# EAGLE design Kube-Module-OLED_AmbiMate (EAGLE 9.5.2)
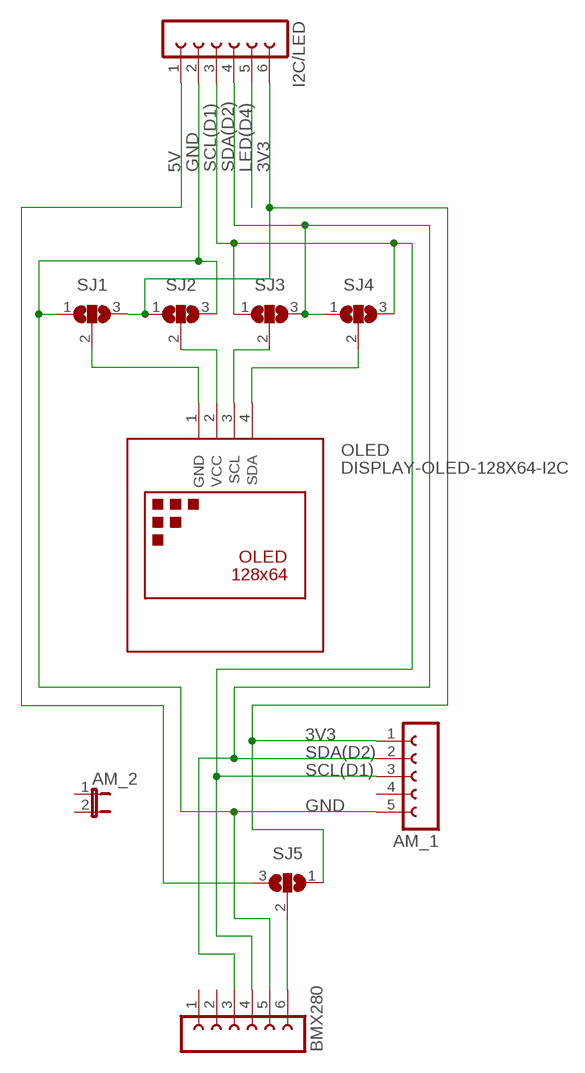
[diagram p0: schematic, sheet 1]

## Parts
AM_1  FE05-1  [FE05-1]
AM_2  JP1E  [JP1]
BMX280  FE06-1  [FE06]
I2C/LED  FE06-1  [FE06]
OLED  DISPLAY-OLED-128X64-I2C  [DISPLAY-OLED-128X64-I2C]
SJ1  SJ2W  [SJ_2]
SJ2  SJ2W  [SJ_2]
SJ3  SJ2W  [SJ_2]
SJ4  SJ2W  [SJ_2]
SJ5  SJ2W  [SJ_2]

## Nets
3V3: AM_1.1 I2C/LED.6 SJ1.3 SJ2.1 SJ5.1
5V: I2C/LED.1 SJ5.3
BMX_VCC: BMX280.6 SJ5.2
GND: AM_1.5 BMX280.5 I2C/LED.2 SJ1.1 SJ2.3
LED(D4): I2C/LED.5
OP1: OLED.1(GND) SJ1.2
OP2: OLED.2(VCC) SJ2.2
OP3: OLED.3(SCL) SJ3.2
OP4: OLED.4(SDA) SJ4.2
SCL(D1): AM_1.3 BMX280.4 I2C/LED.3 SJ3.1 SJ4.3
SDA(D2): AM_1.2 BMX280.3 I2C/LED.4 SJ3.3 SJ4.1
Unconnected: AM_1.4 AM_2.1 AM_2.2 BMX280.1 BMX280.2

## Library data of the parts
AM_1 = con-lsta:FE05-1: FEMALE HEADER; OC_FARNELL: unknown; OC_NEWARK: unknown
AM_2 = jumper:JP1E: JUMPER
BMX280 I2C/LED = con-lsta:FE06-1: FEMALE HEADER; OC_FARNELL: unknown; OC_NEWARK: unknown
OLED = diy-modules:DISPLAY-OLED-128X64-I2C: 128x64 Dot Matrix OLED Module based on SSD1306 chip Variant with I2C interface More details available here: http://www.instructables.com/id/Monochrome-096-i2c-OLED-display-with-arduino-SSD13/ SSD1306 datasheet: https://cdn-shop.adafruit.com/datasheets/SSD1306.pdf Click here to find device on ebay.com <http://www.ebay.com/sch/oled+display+128x64+iic> Note: There are two variants: I2C and SPI. Search for the proper version.
SJ1-SJ5 = jumper:SJ2W: SMD solder JUMPER

## Board
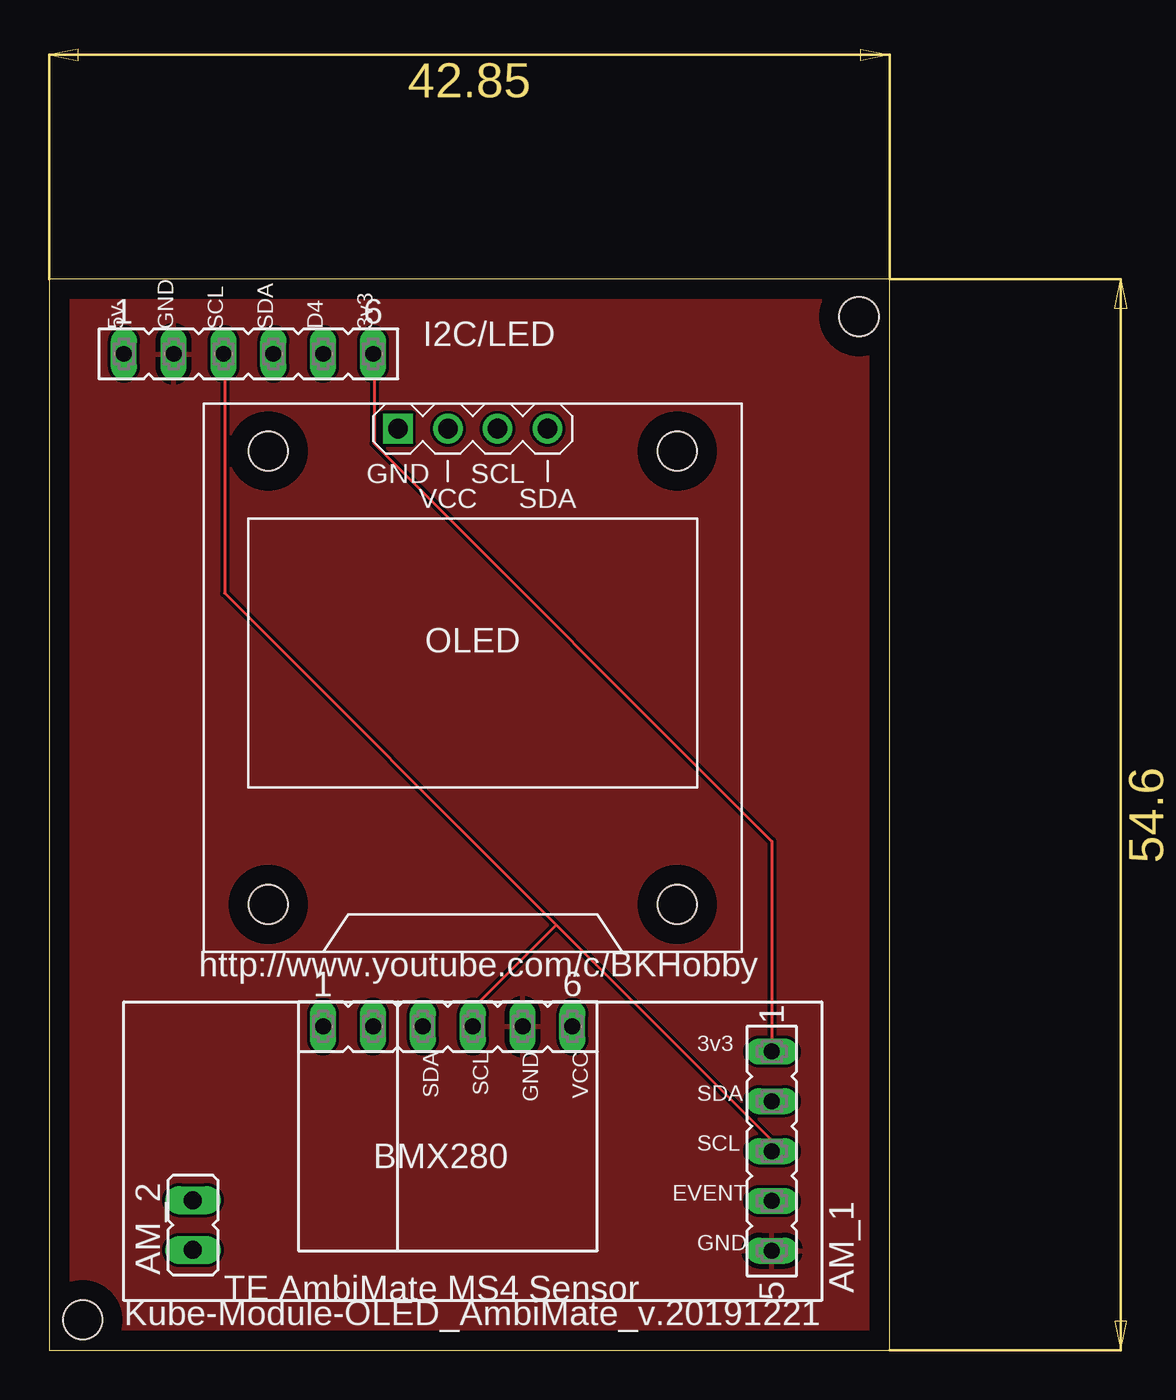
[diagram p1: board, top side]
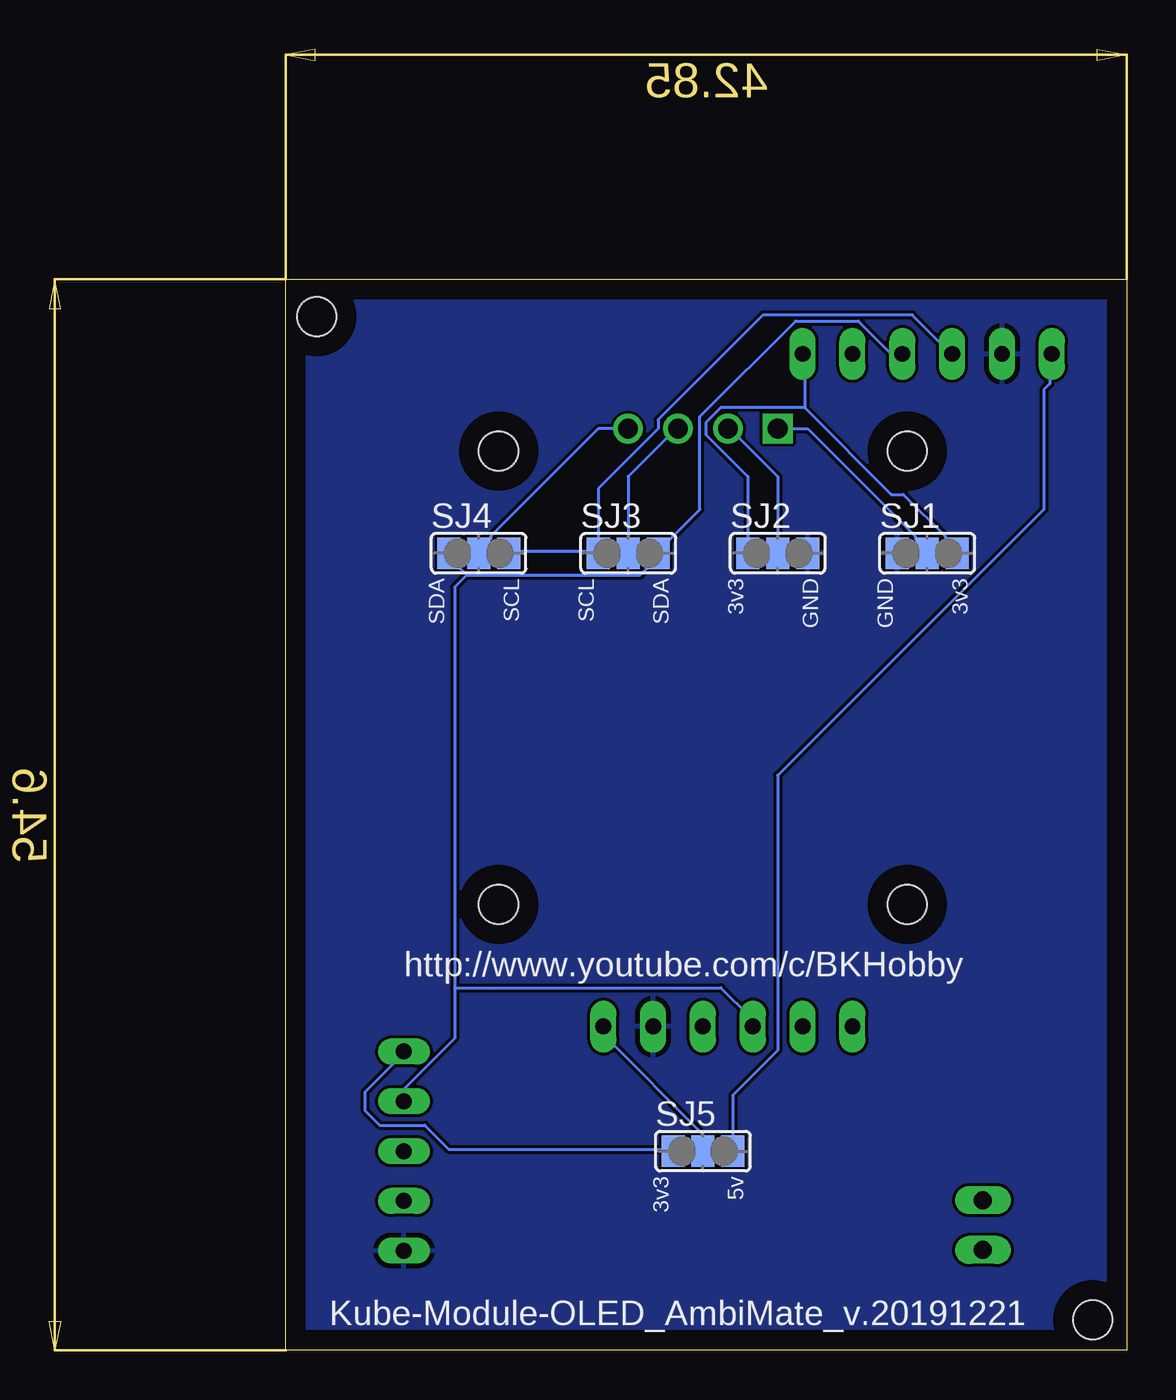
[diagram p2: board, bottom side, seen from below]

Size 42.85 x 54.6 mm. Coordinates in mm from the lower left corner, seen from the top.
Outline: 0,0 42.85,0 42.85,54.6 0,54.6 0,0
Copper layers (1*16): Top 0.035mm / dielectric 1.5mm / Bottom 0.035mm
Design rules "default": minimum track width 6mil, minimum drill 0.35mm, track to track 6mil, track to pad 6mil, pad to pad 6mil, via to via 6mil, smd to smd 6mil, copper to edge 40mil, drill to drill 6mil, minimum pad ring 10mil, minimum via ring 8mil, stop-mask expansion 4mil, vias tented up to drill 0mil, thermal gap 10mil
Holes 2 mm at 41.27,52.7 1.72,1.56

### Footprints (pad centres in the part's own frame; a part is rotated, then mirrored left to right if it is on the bottom)
FE05-1 = drill 0.813 long: 1 -5.08,0; 2 -2.54,0; 3 0,0; 4 2.54,0; 5 5.08,0
JP1 = drill 0.914 long: 1 0,-1.27; 2 0,1.27
FE06 = drill 0.813 long: 1 -6.35,0; 2 -3.81,0; 3 -1.27,0; 4 1.27,0; 5 3.81,0; 6 6.35,0
DISPLAY-OLED-128X64-I2C = drill 1 square: 1 -3.81,12.7 | drill 1: 2 -1.27,12.7; 3 1.27,12.7; 4 3.81,12.7 | hole 2: -10.414,11.557; 10.414,11.557; 10.414,-11.557; -10.414,-11.557
SJ_2 = smd 1.168 x 1.6: 1 -1.524,0; 2 0,0; 3 1.524,0

### Placement (x,y rotation side)
AM_1  36.83,10.16 270 top
AM_2  7.33,6.39 0 top
BMX280  20.32,16.51 0 top
I2C/LED  10.16,50.8 0 top
OLED  21.59,34.29 0 top
SJ1  10.16,40.64 0 bottom
SJ2  17.78,40.64 0 bottom
SJ3  25.4,40.64 0 bottom
SJ4  33.02,40.64 0 bottom
SJ5  21.59,10.16 0 bottom

### Tracks (layer width: path | path; a pad name or v marks a point on that pad's centre or on a via)
3V3
  Top 0.152: AM_1.1 36.83,25.96 16.56,46.23 16.56,50.8 I2C/LED.6
  Bottom 0.152: 16.41,48.06 11.99,43.64 11.38,43.64 9.25,41.5 9.25,41.35 8.64,40.74 SJ1.3 | 16.41,48.06 16.41,50.8 I2C/LED.6 | SJ2.1 19.3,44.55 21.44,46.69 21.44,47.3 20.68,48.06 16.41,48.06 | SJ5.1 23.11,10.26 34.54,10.26 35.76,11.48 38.05,11.48 38.81,12.24 38.81,13.16 36.83,15.14 AM_1.1
5V
  Bottom 0.152: SJ5.3 20.07,13 17.78,15.29 17.78,29.31 4.22,42.88 4.22,48.97 3.91,49.28 3.91,50.8 I2C/LED.1
BMX_VCC
  Bottom 0.152: SJ5.2 21.59,11.02 26.62,16.05 26.62,16.51 BMX280.6
GND
  pour Top: 0,54.61 43.18,54.61 43.18,0 0,0
  pour Bottom: 0,54.61 43.18,54.61 43.18,0 0,0
OP1
  Bottom 0.152: OLED.1 16.26,46.99 10.77,41.5 10.77,41.35 10.16,40.74 SJ1.2
OP2
  Bottom 0.152: SJ2.2 17.78,44.55 20.22,46.99 OLED.2
OP3
  Bottom 0.152: SJ3.2 25.4,44.55 22.96,46.99 OLED.3
OP4
  Bottom 0.152: OLED.4 26.92,46.99 32.41,41.5 32.41,41.35 33.02,40.74 SJ4.2
SCL(D1)
  Top 0.152: AM_1.3 36.83,10.72 25.86,21.69 | 25.86,21.69 8.94,38.61 8.94,50.8 I2C/LED.3 | BMX280.4 21.59,17.42 25.86,21.69
  Bottom 0.152: 26.92,40.74 31.5,40.74 SJ4.3 | 26.92,40.74 26.92,43.94 23.88,46.99 23.88,47.45 18.54,52.78 10.92,52.78 8.94,50.8 I2C/LED.3 | 26.92,40.74 SJ3.1
SDA(D2)
  Bottom 0.152: 33.63,39.52 24.79,39.52 24.49,39.83 24.49,39.98 23.88,40.59 SJ3.3 23.88,40.74 21.74,42.88 21.74,47.6 16.87,52.48 13.66,52.48 11.99,50.8 I2C/LED.4 | 33.63,39.52 34.54,40.44 SJ4.1 | AM_1.2 36.83,13.31 34.24,15.9 34.24,18.49 | 34.24,18.49 34.24,38.91 33.63,39.52 | 34.24,18.49 20.68,18.49 19.15,16.97 19.15,16.51 BMX280.3

### Text on the board
tNames: 5v | GND | SCL | SDA | D4 | 3v3 | http://www.youtube.com/c/BKHobby | SDA | SCL | GND | VCC | 3v3 | SDA | SCL | EVENT | GND | TE AmbiMate MS4 Sensor | Kube-Module-OLED_AmbiMate_v.20191221
bNames: 3v3 | GND | GND | 3v3 | SDA | SCL | SCL | SDA | http://www.youtube.com/c/BKHobby | 5v | 3v3 | Kube-Module-OLED_AmbiMate_v.20191221